# EAGLE schematic eCog105_Joystick_PS2 (EAGLE 6.6.0)
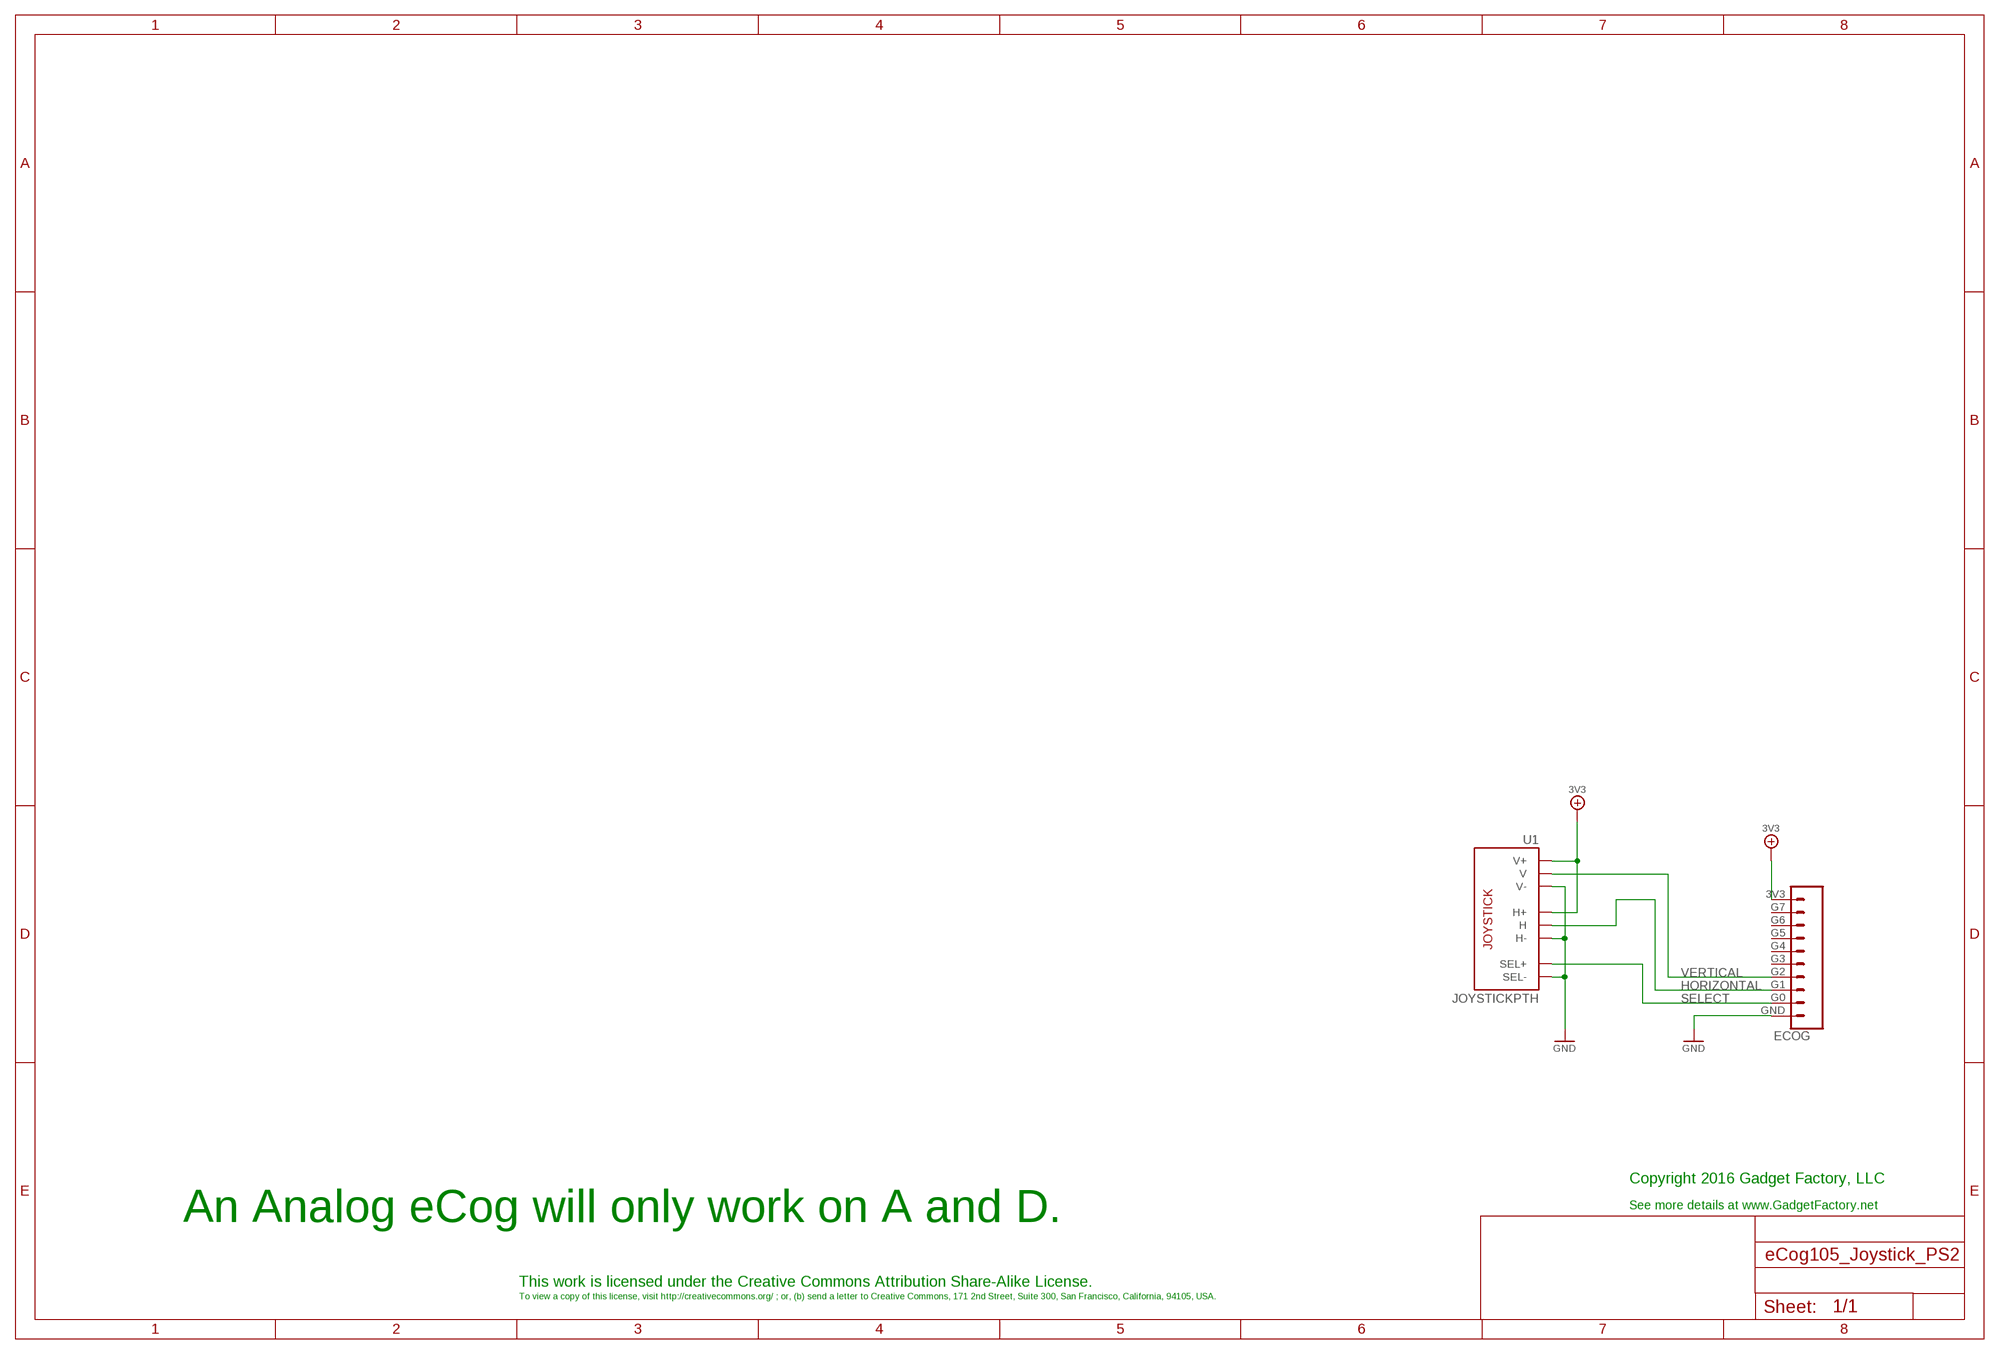
[diagram p0: schematic, sheet 1]

## Parts
ECOG  ECOG_GENERAL_ROWECOG_GENERAL_SMD  [ECOG_GENERAL_SMD]
U1  JOYSTICKPTH  [JOYSTICK]

## Nets
3V3: ECOG.3V3 U1.H1(H+) U1.V1(V+)
GND: ECOG.GND U1.B2A(SEL-) U1.H3(H-) U1.V3(V-)
HORIZONTAL: ECOG.G1 U1.H2(H)
SELECT: ECOG.G0 U1.B1A(SEL+)
VERTICAL: ECOG.G2 U1.V2(V)
Unconnected: ECOG.G3 ECOG.G4 ECOG.G5 ECOG.G6 ECOG.G7

## Notes on the sheet
- Copyright 2016 Gadget Factory, LLC
- See more details at www.GadgetFactory.net
- An Analog eCog will only work on A and D.
- This work is licensed under the Creative Commons Attribution Share-Alike License.
- To view a copy of this license, visit http://creativecommons.org/ ; or, (b) send a letter to Creative Commons, 171 2nd Street, Suite 300, San Francisco, California, 94105, USA.

## Library data of the parts
ECOG = eCogs:ECOG_GENERAL_ROW; DIGIKEY: S1013EC-10-ND
U1 = adafruit:JOYSTICK: Thumb Joystick Joystick commonly found in PS2 controllers. Two pots and a select switch. Adapted from Sparkfun Library (but for more common 6mm switch sticks); SPARKFUN: COM-09032